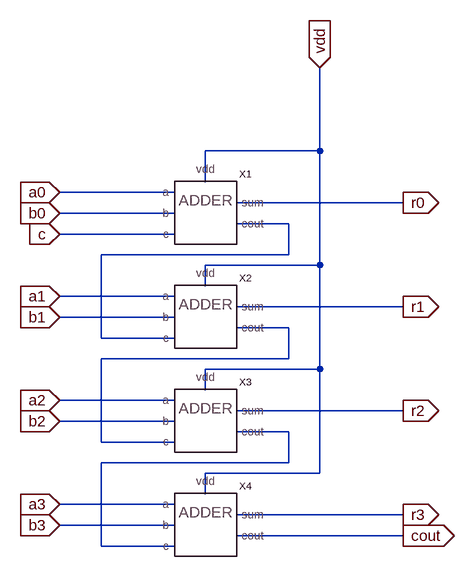
[diagram p0: schematic 4bitAdder.asc]
4bitAdder.asc, the LTspice schematic file:
Version 4
SHEET 1 916 680
WIRE 560 -592 560 -720
WIRE 560 -592 384 -592
WIRE 384 -544 384 -592
WIRE 336 -528 160 -528
WIRE 688 -512 432 -512
WIRE 336 -496 160 -496
WIRE 512 -480 432 -480
WIRE 336 -464 160 -464
WIRE 512 -432 512 -480
WIRE 512 -432 224 -432
WIRE 560 -416 560 -592
WIRE 560 -416 384 -416
WIRE 384 -384 384 -416
WIRE 336 -368 160 -368
WIRE 688 -352 432 -352
WIRE 336 -336 160 -336
WIRE 512 -320 432 -320
WIRE 224 -304 224 -432
WIRE 336 -304 224 -304
WIRE 512 -272 512 -320
WIRE 512 -272 224 -272
WIRE 560 -256 560 -416
WIRE 560 -256 384 -256
WIRE 384 -224 384 -256
WIRE 336 -208 160 -208
WIRE 688 -192 432 -192
WIRE 336 -176 160 -176
WIRE 512 -160 432 -160
WIRE 224 -144 224 -272
WIRE 336 -144 224 -144
WIRE 512 -112 512 -160
WIRE 512 -112 224 -112
WIRE 560 -96 560 -256
WIRE 560 -96 384 -96
WIRE 384 -64 384 -96
WIRE 336 -48 160 -48
WIRE 688 -32 432 -32
WIRE 336 -16 160 -16
WIRE 688 0 432 0
WIRE 224 16 224 -112
WIRE 336 16 224 16
FLAG 160 -336 b1
IOPIN 160 -336 In
FLAG 160 -368 a1
IOPIN 160 -368 In
FLAG 160 -176 b2
IOPIN 160 -176 In
FLAG 160 -208 a2
IOPIN 160 -208 In
FLAG 160 -16 b3
IOPIN 160 -16 In
FLAG 160 -48 a3
IOPIN 160 -48 In
FLAG 160 -528 a0
IOPIN 160 -528 In
FLAG 160 -496 b0
IOPIN 160 -496 In
FLAG 688 -352 r1
IOPIN 688 -352 Out
FLAG 688 -192 r2
IOPIN 688 -192 Out
FLAG 688 -32 r3
IOPIN 688 -32 Out
FLAG 688 -512 r0
IOPIN 688 -512 Out
FLAG 688 0 cout
IOPIN 688 0 Out
FLAG 560 -720 vdd
IOPIN 560 -720 In
FLAG 160 -464 c
IOPIN 160 -464 In
SYMBOL adder 384 -496 R0
SYMATTR InstName X1
SYMBOL adder 384 -336 R0
SYMATTR InstName X2
SYMBOL adder 384 -176 R0
SYMATTR InstName X3
SYMBOL adder 384 -16 R0
SYMATTR InstName X4

The netlist it stands for:
* 4bitAdder.asc
XX1 a0 b0 c vdd r0 N001 adder  ; pins a b c vdd sum cout
XX2 a1 b1 N001 vdd r1 N002 adder  ; pins a b c vdd sum cout
XX3 a2 b2 N002 vdd r2 N003 adder  ; pins a b c vdd sum cout
XX4 a3 b3 N003 vdd r3 cout adder  ; pins a b c vdd sum cout
.backanno
.end